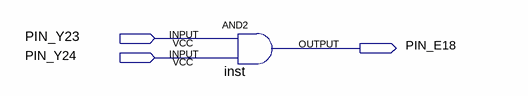
[diagram p0: schematic sheet]
// Quartus schematic Introducao_FPGA.bdf as structural Verilog: 1 symbols, 3 pins
module Introducao_FPGA (
  input  PIN_Y23,
  input  PIN_Y24,
  output PIN_E18
);

  and inst (PIN_E18, PIN_Y23, PIN_Y24);
endmodule
